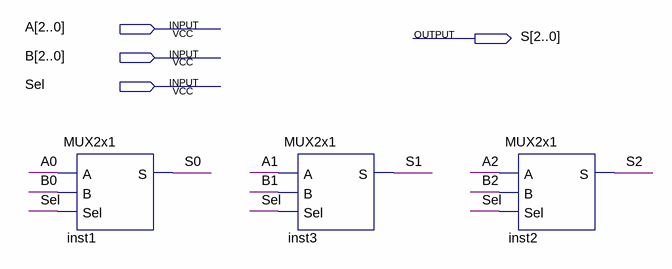
[diagram p0: schematic sheet]
// Quartus schematic MUX2x3.bdf as structural Verilog: 3 symbols, 4 pins
module MUX2x3 (
  input  [2:0] A,
  input  [2:0] B,
  input  Sel,
  output [2:0] S
);

  MUX2x1 inst1 (.A(A[0]), .B(B[0]), .Sel(Sel), .S(S[0]));
  MUX2x1 inst3 (.A(A[1]), .B(B[1]), .Sel(Sel), .S(S[1]));
  MUX2x1 inst2 (.A(A[2]), .B(B[2]), .Sel(Sel), .S(S[2]));
endmodule
